# Altium schematic sheet 红外热释电家庭防盗报警.SCHDOC
size A4
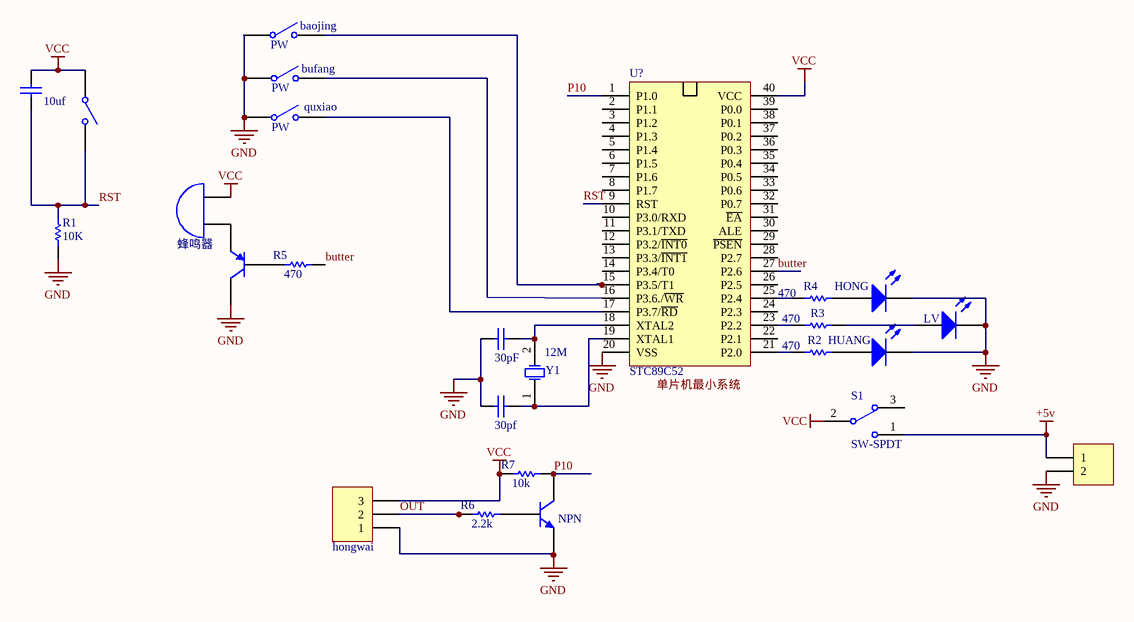
[diagram p0: 红外热释电家庭防盗报警.SCHDOC]

## Parts
*  蜂鸣器
baojing  PW
bufang  PW
C1  10uf
C2  30pf  [RAD-0.3]
C20  value 30pF  [RAD-0.3]
HONG  LED  (value not drawn)
HUANG  LED  (value not drawn)
LV  LED  (value not drawn)
P21  hongwai  [HDR1X3]
P?  Header 2  [HDR1X2]  (value not drawn)
PNP  PNP  (value not drawn)
PW1  PW  (value not drawn)
Q?  NPN  [TO-226]
quxiao  PW
R1  10K
R2  470
R3  470
R4  470
R5  470
R6  2.2k
R7  10k
S1  SW-SPDT  [TL36WW15050]
U?  STC89C52  [STC89C52]
Y1  12M  [R38]

## Nets
+5v: P?.1 S1.1
GND: baojing.1(COMMON) bufang.1(COMMON) C2.1 C20.1 HONG.2(K) HUANG.2(K) LV.2(K) P21.1 P?.2 PNP.1(C) Q?.3(E) quxiao.1(COMMON) R1.1 U?.20(VSS)
VCC: *.2(B) C1.1 P21.3 PW1.1(COMMON) R7.2 S1.2 U?.40(VCC)
butter: R5.1 U?.27(P2.6)
OUT: P21.2 R6.2
P10: Q?.1(C) R7.1 U?.1(P1.0)
RST: C1.2 PW1.2(NO) R1.2 U?.9(RST)
Net*_1: *.1(A) PNP.3(E)
Netbaojing_2: baojing.2(NO) U?.15(P3.5/T1)
Netbufang_2: bufang.2(NO) U?.16(P3.6./~{WR})
NetC2_2: C2.2 U?.19(XTAL1) Y1.1(OSC1)
NetC20_2: C20.2 U?.18(XTAL2) Y1.2(OSC2)
NetHONG_1: HONG.1(A) R4.2
NetHUANG_1: HUANG.1(A) R2.2
NetLV_1: LV.1(A) R3.1
NetPNP_2: PNP.2(B) R5.2
NetQ?_2: Q?.2(B) R6.1
Netquxiao_2: quxiao.2(NO) U?.17(P3.7/~{RD})
NetR2_1: R2.1 U?.21(P2.0)
NetR3_2: R3.2 U?.23(P2.2)
NetR4_1: R4.1 U?.25(P2.4)

Not connected (* = marked no-connect by the designer): S1 3; U? 2(P1.1) 3(P1.2) 4(P1.3) 5(P1.4) 6(P1.5) 7(P1.6) 8(P1.7) 10(P3.0/RXD) 11(P3.1/TXD) 12(P3.2/~{INT0}) 13(P3.3/~{INT1}) 14(P3.4/T0) 22(P2.1) 24(P2.3) 26(P2.5) 28(P2.7) 29(~{PSEN}) 30(ALE) 31(~{EA}) 32(P0.7) 33(P0.6) 34(P0.5) 35(P0.4) 36(P0.3) 37(P0.2) 38(P0.1) 39(P0.0)

## Notes on the sheet
- Labels drawn without touching a wire or pin: 单片机最小系统

## Library data of the parts
C1 = CAP
C2 C20 = Cap: Capacitor; Published: 8-Jun-2000; LatestRevisionDate: 17-Jul-2002; LatestRevisionNote: Re-released for DXP Platform.; PackageReference: RAD-0.3; Publisher: Altium Limited
P21 = Header 3: Header, 3-Pin; LatestRevisionDate: 17-Jul-2002; LatestRevisionNote: Re-released for DXP Platform.; Publisher: Altium Limited
P? = Header 2: Header, 2-Pin; LatestRevisionDate: 17-Jul-2002; LatestRevisionNote: Re-released for DXP Platform.; Publisher: Altium Limited
Q? = NPN: NPN Bipolar Transistor; Published: 8-Jun-2000; LatestRevisionDate: 17-Jul-2002; LatestRevisionNote: Re-released for DXP Platform.; PackageReference: TO-226; Publisher: Altium Limited; Code_JEDEC: TO-226-AA
R1-R7 = resist
S1 = SW-SPDT: SPDT Subminiature Toggle Switch, Right Angle Mounting, Vertical Actuation; Published: 24-Mar-1999; LatestRevisionDate: 17-Dec-2003; LatestRevisionNote: Schematic revised, PCB Footprint replaced.; DatasheetDocument: 05-Dec-2000; PackageReference: TL36WW15050; Publisher: Altium Limited; ComponentLink1Description: Manufacturer Link; ComponentLink1URL: http://www.apem.com
Y1 = XTAL: Crystal Oscillator; Published: 8-Jun-2000; LatestRevisionDate: 17-Jul-2002; LatestRevisionNote: Re-released for DXP Platform.; PackageReference: R38; Publisher: Altium Limited